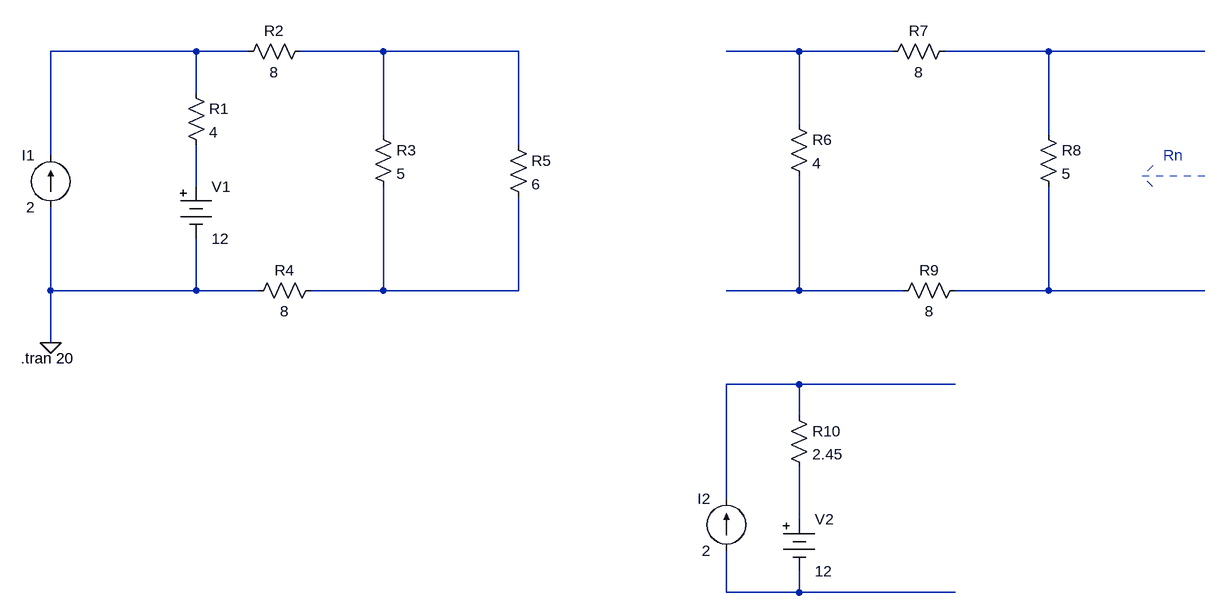
[diagram p0: schematic Lab_010_Norton_Theorem.asc]
Lab_010_Norton_Theorem.asc, the LTspice schematic file:
Version 4
SHEET 1 1924 792
WIRE 368 -48 144 -48
WIRE 448 -48 368 -48
WIRE 656 -48 528 -48
WIRE 864 -48 656 -48
WIRE 1296 -48 1184 -48
WIRE 1440 -48 1296 -48
WIRE 1680 -48 1520 -48
WIRE 1920 -48 1680 -48
WIRE 368 16 368 -48
WIRE 1296 64 1296 -48
WIRE 656 80 656 -48
WIRE 1680 80 1680 -48
WIRE 864 96 864 -48
WIRE 144 112 144 -48
WIRE 368 160 368 96
WIRE 144 320 144 192
WIRE 368 320 368 240
WIRE 368 320 144 320
WIRE 464 320 368 320
WIRE 656 320 656 160
WIRE 656 320 544 320
WIRE 864 320 864 176
WIRE 864 320 656 320
WIRE 1296 320 1296 144
WIRE 1296 320 1184 320
WIRE 1456 320 1296 320
WIRE 1680 320 1680 160
WIRE 1680 320 1536 320
WIRE 1920 320 1680 320
WIRE 144 400 144 320
WIRE 1296 464 1184 464
WIRE 1536 464 1296 464
WIRE 1296 512 1296 464
WIRE 1184 640 1184 464
WIRE 1296 672 1296 592
WIRE 1184 784 1184 720
WIRE 1296 784 1296 752
WIRE 1296 784 1184 784
WIRE 1536 784 1296 784
FLAG 144 400 0
SYMBOL current 144 192 R180
WINDOW 0 24 80 Left 2
WINDOW 3 24 0 Left 2
WINDOW 123 0 0 Left 0
WINDOW 39 0 0 Left 0
SYMATTR InstName I1
SYMATTR Value 2
SYMBOL res 352 0 R0
SYMATTR InstName R1
SYMATTR Value 4
SYMBOL Misc\\battery 368 144 R0
SYMATTR InstName V1
SYMATTR Value 12
SYMBOL res 544 -64 R90
WINDOW 0 0 56 VBottom 2
WINDOW 3 32 56 VTop 2
SYMATTR InstName R2
SYMATTR Value 8
SYMBOL res 640 64 R0
SYMATTR InstName R3
SYMATTR Value 5
SYMBOL res 560 304 R90
WINDOW 0 0 56 VBottom 2
WINDOW 3 32 56 VTop 2
SYMATTR InstName R4
SYMATTR Value 8
SYMBOL res 848 80 R0
SYMATTR InstName R5
SYMATTR Value 6
SYMBOL res 1280 48 R0
SYMATTR InstName R6
SYMATTR Value 4
SYMBOL res 1536 -64 R90
WINDOW 0 0 56 VBottom 2
WINDOW 3 32 56 VTop 2
SYMATTR InstName R7
SYMATTR Value 8
SYMBOL res 1664 64 R0
SYMATTR InstName R8
SYMATTR Value 5
SYMBOL res 1552 304 R90
WINDOW 0 0 56 VBottom 2
WINDOW 3 32 56 VTop 2
SYMATTR InstName R9
SYMATTR Value 8
SYMBOL current 1184 720 R180
WINDOW 0 24 80 Left 2
WINDOW 3 24 0 Left 2
SYMATTR InstName I2
SYMATTR Value 2
SYMBOL Misc\\battery 1296 656 R0
SYMATTR InstName V2
SYMATTR Value 12
SYMBOL res 1280 496 R0
SYMATTR InstName R10
SYMATTR Value 2.45
TEXT 98 424 Left 2 !.tran 20
TEXT 1856 112 Left 2 ;Rn
LINE Normal 1920 144 1824 144 2
LINE Normal 1840 128 1824 144 2
LINE Normal 1840 160 1824 144 2

The netlist it stands for:
* Lab_010_Norton_Theorem.asc
I1 0 N001 2
R1 N001 N005 4
V1 N005 0 12
R2 N002 N001 8
R3 N002 N006 5
R4 N006 0 8
R5 N002 N006 6
R6 N003 N007 4
R7 N004 N003 8
R8 N004 N008 5
R9 N008 N007 8
I2 N011 N009 2
V2 N010 N011 12
R10 N009 N010 2.45
.tran 20
* Rn
.backanno
.end